# EAGLE design led_disp (EAGLE 7.7.0)
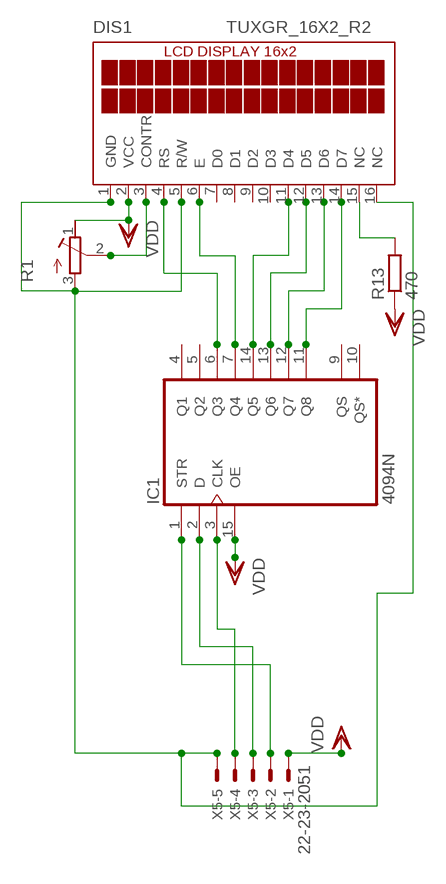
[diagram p0: schematic, sheet 1]

## Parts
DIS1  TUXGR_16X2_R2  [TUXGR_16X2_R2]
IC1  4094N  [DIL16]
R1  R-TRIMMT93YA  [RTRIMT93YA]
R13  470  R-EU_0207/10  [0207/10]
X5  22-23-2051  [22-23-2051]

## Nets
E: DIS1.6(E) IC1.7(Q4)
N$1: DIS1.3(CONTR) R1.2(S)
N$2: DIS1.11(D4) IC1.14(Q5)
N$3: DIS1.12(D5) IC1.13(Q6)
N$4: DIS1.13(D6) IC1.12(Q7)
N$5: DIS1.14(D7) IC1.11(Q8)
N$31: IC1.3(CLK) X5.4
N$32: IC1.2(D) X5.3
N$33: IC1.1(STR) X5.2
N$35: DIS1.15(NC) R13.2
RS: DIS1.4(RS) IC1.6(Q3)
VDD: DIS1.2(VCC) IC1.15(OE) R1.1(E) R13.1 X5.1
VSS: DIS1.1(GND) DIS1.5(R/W) DIS1.16(NC) R1.3(A) X5.5
Unconnected: DIS1.7(D0) DIS1.8(D1) DIS1.9(D2) DIS1.10(D3) IC1.4(Q1) IC1.5(Q2) IC1.9(QS) IC1.10(QS*)

## Power pins joined to a net without a drawn wire
VDD: IC1.16(VDD)
VSS: IC1.8(VSS)

## Library data of the parts
DIS1 = display-lcd:TUXGR_16X2_R2: Tuxgraphics LCD display 16x2 characters reflective, without background light Source: tuxgr_12x2_r2.pdf; OC_FARNELL: unknown; OC_NEWARK: unknown
IC1 = 40xx:4094: 8-stage SHIFT/STORE REGISTER, tri-state
R1 = rcl:R-TRIMM: Trimm resistor
R13 = resistor:R-EU_: RESISTOR, European symbol
X5 = con-molex:22-23-2051: .100" (2.54mm) Center Header - 5 Pin; MF: MOLEX; MPN: 22-23-2051; OC_FARNELL: 1462952; OC_NEWARK: 38C9178

## Board
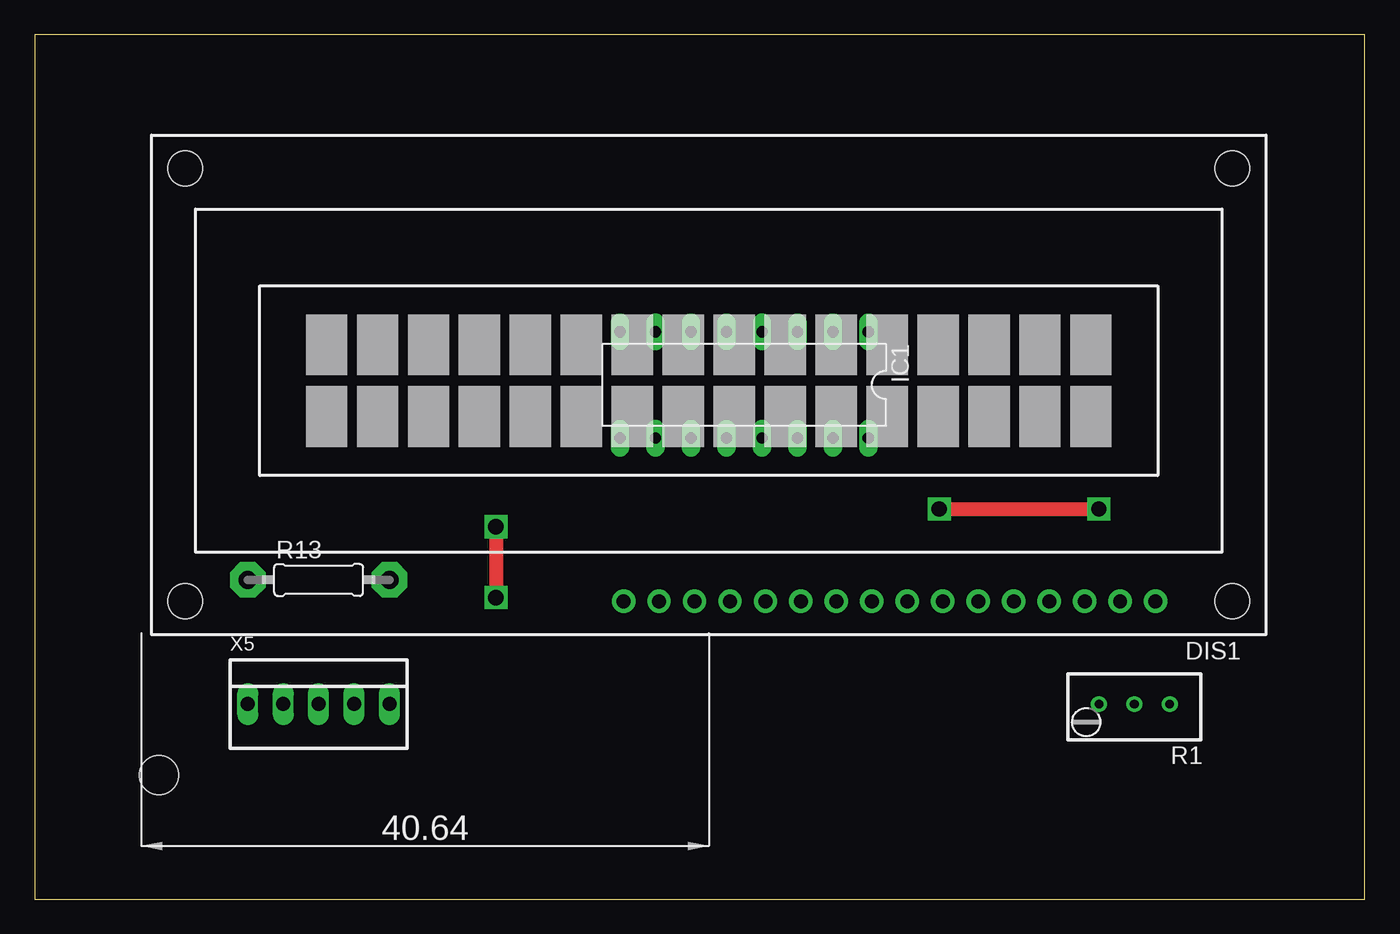
[diagram p1: board, top side]
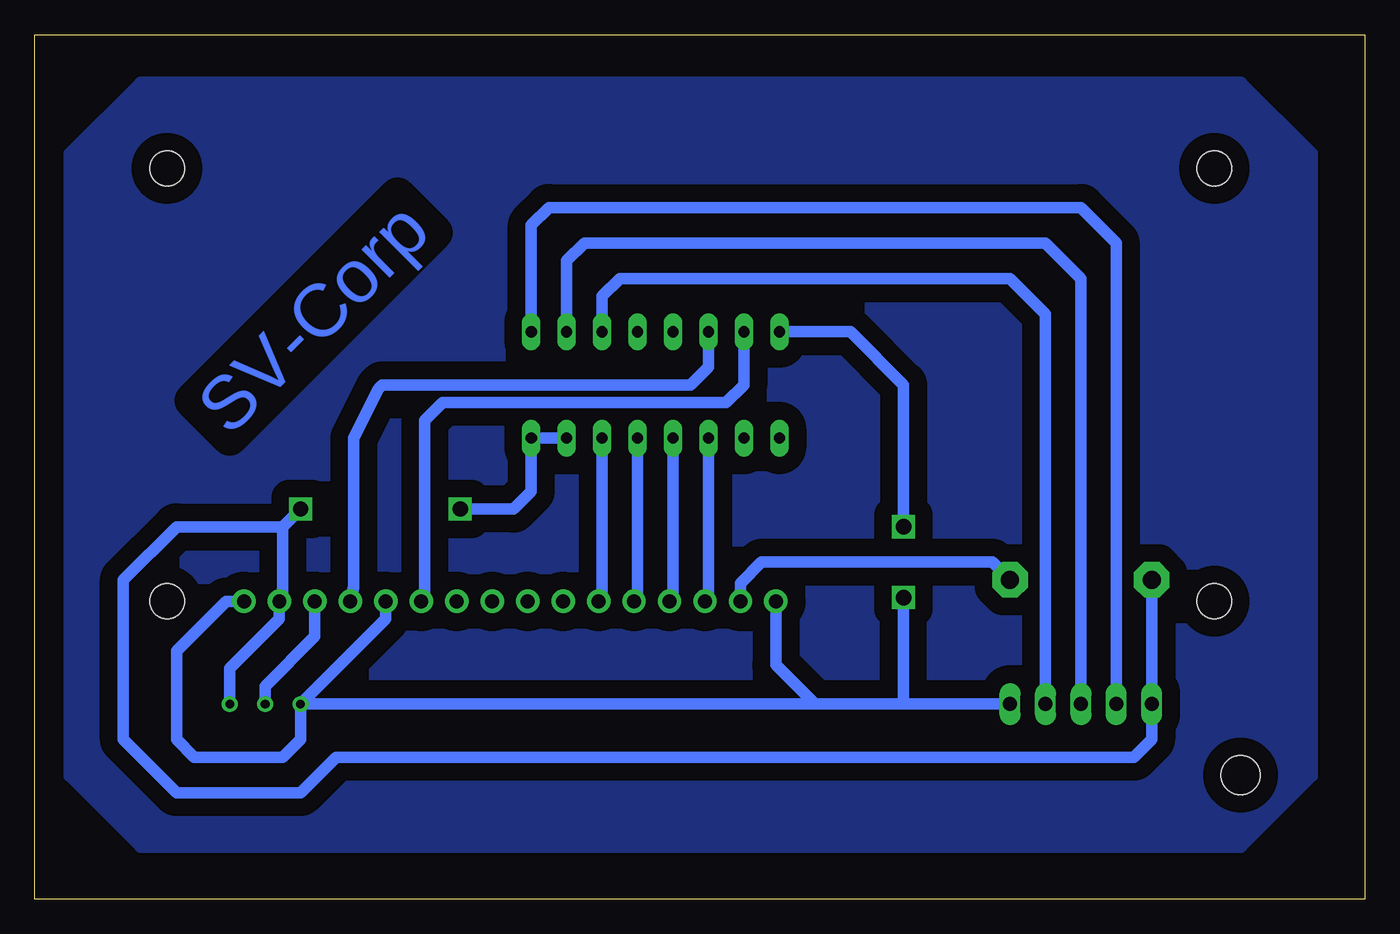
[diagram p2: board, bottom side, seen from below]

Size 95.23 x 61.9 mm. Coordinates in mm from the lower left corner, seen from the top.
Outline: 0,0 95.23,0 95.23,61.9 0,61.9 0,0
Copper layers (1*16): Top 0.035mm / dielectric 1.5mm / Bottom 0.035mm
Design rules "default": minimum track width 10mil, minimum drill 24mil, track to track 8mil, track to pad 8mil, pad to pad 8mil, via to via 8mil, smd to smd 8mil, copper to edge 40mil, drill to drill 8mil, minimum pad ring 10mil, minimum via ring 8mil, stop-mask expansion 4mil, vias tented up to drill 0mil, thermal gap 10mil
Holes 2.8 mm at 8.89,8.89

### Footprints (pad centres in the part's own frame; a part is rotated, then mirrored left to right if it is on the bottom)
TUXGR_16X2_R2 = drill 1 pad 1.676: 1 -32,15.5; 2 -29.46,15.5; 3 -26.92,15.5; 4 -24.38,15.5; 5 -21.84,15.5; 6 -19.3,15.5; 7 -16.76,15.5; 8 -14.22,15.5; 9 -11.68,15.5; 10 -9.14,15.5; 11 -6.6,15.5; 12 -4.06,15.5; 13 -1.52,15.5; 14 1.02,15.5; 15 3.56,15.5; 16 6.1,15.5 | hole 2.5: -37.5,-15.5; 37.5,-15.5; -37.5,15.5; 37.5,15.5
DIL16 = drill 0.813 long: 1 -8.89,-3.81; 2 -6.35,-3.81; 3 -3.81,-3.81; 4 -1.27,-3.81; 5 1.27,-3.81; 6 3.81,-3.81; 7 6.35,-3.81; 8 8.89,-3.81; 9 8.89,3.81; 10 6.35,3.81; 11 3.81,3.81; 12 1.27,3.81; 13 -1.27,3.81; 14 -3.81,3.81; 15 -6.35,3.81; 16 -8.89,3.81
RTRIMT93YA = drill 0.61: 1 0,-2.54; 2 0,0; 3 0,2.54
0207/10 = drill 1.27 pad 2.54 octagon: 1 -5.08,0; 2 5.08,0
22-23-2051 = drill 1 long: 1 -5.08,0; 2 -2.54,0; 3 0,0; 4 2.54,0; 5 5.08,0

### Placement (x,y rotation side)
DIS1  48.26,36.83 180 top
IC1  50.8,36.83 180 top
R1  78.74,13.97 90 top
R13  20.32,22.86 0 top
X5  20.32,13.97 0 top

### Tracks (layer width: path | path; a pad name or v marks a point on that pad's centre or on a via)
E
  Bottom 0.813: IC1.7 44.45,36.83 45.72,35.56 66.04,35.56 67.31,34.29 67.31,21.58 DIS1.6
N$1
  Bottom 0.813: DIS1.3 75.18,18.8 78.74,15.24 R1.2
N$2
  Bottom 0.813: IC1.14 54.61,21.58 DIS1.11
N$3
  Bottom 0.813: IC1.13 52.07,21.58 DIS1.12
N$4
  Bottom 0.813: IC1.12 49.53,21.58 DIS1.13
N$5
  Bottom 0.813: IC1.11 46.99,21.58 DIS1.14
N$14
  pour Bottom (isolate 1.27): 8.89,58.42 87.63,58.42 92.71,53.34 92.71,8.89 87.63,3.81 8.89,3.81 3.81,8.89 3.81,53.34
N$31
  Bottom 0.813: IC1.3 54.61,43.18 53.34,44.45 25.4,44.45 22.86,41.91 X5.4
N$32
  Bottom 0.813: IC1.2 57.15,45.72 55.88,46.99 22.86,46.99 20.32,44.45 X5.3
N$33
  Bottom 0.813: IC1.1 59.69,48.26 58.42,49.53 20.32,49.53 17.78,46.99 X5.2
N$35
  Bottom 0.813: DIS1.15 44.7,22.61 43.18,24.13 26.67,24.13 R13.2
RS
  Bottom 0.813: IC1.6 46.99,38.1 48.26,36.83 70.36,36.83 70.61,36.58 72.39,33.02 72.39,22.35 DIS1.4
VDD  (via drill 1.1)
  Top 1.016: v64.77,27.94 v76.2,27.94
  Bottom 0.813: IC1.15 IC1.16 59.69,29.21 60.96,27.94 v64.77,27.94 | R1.1 81.28,16.51 77.72,20.07 DIS1.2 77.47,21.58 77.47,26.67 | 77.47,26.67 v76.2,27.94 | 77.47,26.67 85.09,26.67 88.9,22.86 88.9,11.43 85.09,7.62 76.2,7.62 73.66,10.16 16.51,10.16 15.24,11.43 X5.1 R13.1
VSS  (via drill 1.1)
  Top 1.016: v33.02,26.67 v33.02,21.59
  Bottom 0.813: IC1.8 36.83,40.64 33.02,36.83 v33.02,26.67 | DIS1.1 81.54,21.33 85.09,17.78 85.09,11.43 83.82,10.16 77.47,10.16 76.2,11.43 R1.3 | DIS1.5 70.1,20.07 R1.3 | X5.5 33.02,13.97 | 33.02,13.97 39.37,13.97 | 39.37,13.97 R1.3 | DIS1.16 42.16,16.76 39.37,13.97 | 33.02,13.97 v33.02,21.59

### Text on the board
Bottom: SV-Corp